# Altium schematic sheet Sheet4.SchDoc
size A3; SheetNumber: 4; SheetTotal: 4
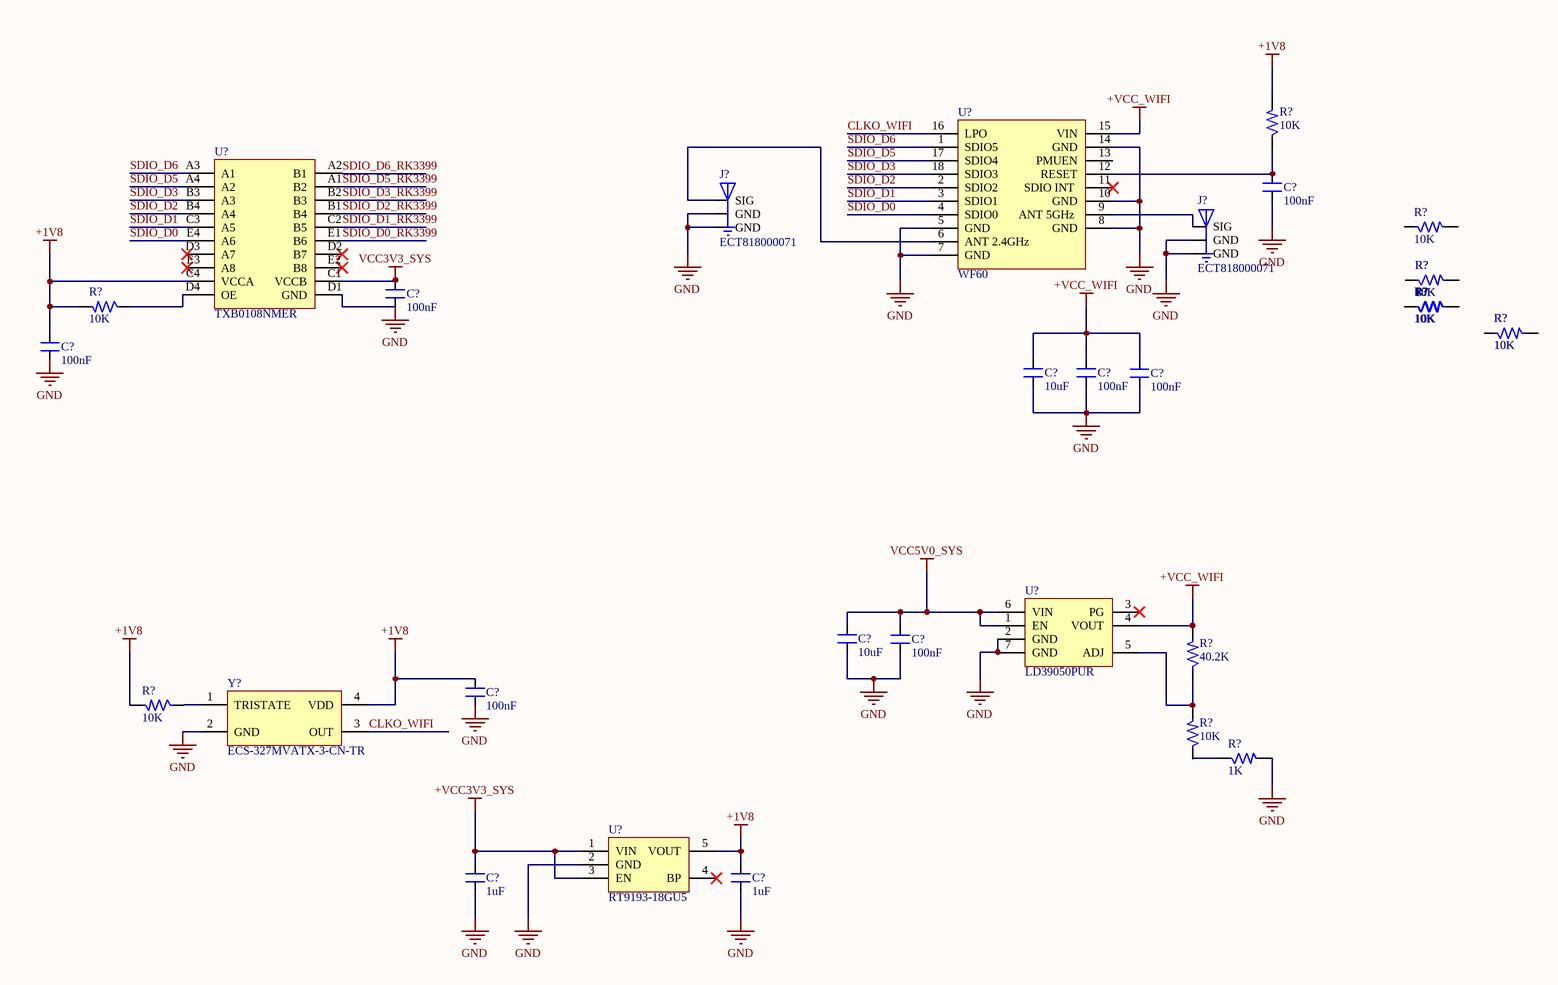
[diagram p0: Sheet4.SchDoc]

## Parts
(Parts that share a designator on the sheet are numbered #1, #2 ... from top to bottom, then left to right.)
C?#1  100nF  [CAP_0402]
C?#2  100nF  [CAP_0402]
C?#3  100nF  [CAP_0402]
C?#4  10uF  [CAP_0402]
C?#5  100nF  [CAP_0402]
C?#6  100nF  [CAP_0402]
C?#7  10uF  [CAP_0402]
C?#8  100nF  [CAP_0402]
C?#9  100nF  [CAP_0402]
C?#10  1uF  [CAP_0402]
C?#11  1uF  [CAP_0402]
J?#1  ECT818000071  [CON3_UFL_116_SMD_ST]
J?#2  ECT818000071  [CON3_UFL_116_SMD_ST]
R?#1  10K  [RES_0201]
R?#2  10K  [RES_0603]
R?#3  10K  [RES_0603]
R?#4  10K  [RES_0603]
R?#5  10K  [RES_0201]
R?#6  10K  [RES_0603]
R?#7  10K  [RES_0603]
R?#8  10K  [RES_0603]
R?#9  10K  [RES_0603]
R?#10  40.2K  [RES_0805]
R?#11  10K  [RES_0201]
R?#12  10K  [RES_0201]
R?#13  1K  [RES_0603]
U?#1  WF60  [MOD_WF60]
U?#2  TXB0108NMER  [NFBGA_31.4_125.9X102.36]
U?#3  LD39050PUR  [DFN-6_37.4_165_33X15_SMD]
U?#4  RT9193-18GU5  [SC70-5]
Y?  ECS-327MVATX-3-CN-TR  [XTAL_57_35X31_SMD]

## Nets
+1V8: C?#3.2 C?#9.2 C?#11.2 R?#1.2 R?#5.2 R?#11.2 U?#2.C4(VCCA) U?#4.5(VOUT) Y?.4(VDD)
+VCC3V3_SYS: C?#10.2 U?#4.1(VIN) U?#4.3(EN)
+VCC_WIFI: C?#4.2 C?#5.2 C?#6.2 R?#10.2 U?#1.15(VIN) U?#3.4(VOUT)
GND: C?#1.1 C?#2.1 C?#3.1 C?#4.1 C?#5.1 C?#6.1 C?#7.1 C?#8.1 C?#9.1 C?#10.1 C?#11.1 J?#1.1(GND) J?#1.3(GND) J?#2.1(GND) J?#2.3(GND) R?#13.2 U?#1.5(GND) U?#1.7(GND) U?#1.8(GND) U?#1.10(GND) U?#1.14(GND) U?#2.D1(GND) U?#3.2(GND) U?#3.7(GND) U?#4.2(GND) Y?.2(GND)
VCC3V3_SYS: C?#2.2 U?#2.C1(VCCB)
VCC5V0_SYS: C?#7.2 C?#8.2 U?#3.1(EN) U?#3.6(VIN)
CLKO_WIFI: U?#1.16(LPO) Y?.3(OUT)
SDIO_D0: U?#1.4(SDIO0) U?#2.E4(A6)
SDIO_D0_RK3399: U?#2.E1(B6)
SDIO_D1: U?#1.3(SDIO1) U?#2.C3(A5)
SDIO_D1_RK3399: U?#2.C2(B5)
SDIO_D2: U?#1.2(SDIO2) U?#2.B4(A4)
SDIO_D2_RK3399: U?#2.B1(B4)
SDIO_D3: U?#1.18(SDIO3) U?#2.B3(A3)
SDIO_D3_RK3399: U?#2.B2(B3)
SDIO_D5: U?#1.17(SDIO4) U?#2.A4(A2)
SDIO_D5_RK3399: U?#2.A1(B2)
SDIO_D6: U?#1.1(SDIO5) U?#2.A3(A1)
SDIO_D6_RK3399: U?#2.A2(B1)
NetC?#1_2: C?#1.2 R?#1.1 U?#1.12(RESET)
NetJ?#1_2: J?#1.2(SIG) U?#1.6(ANT_2.4GHz)
NetJ?#2_2: J?#2.2(SIG) U?#1.9(ANT_5GHz)
NetR?#3_1: R?#3.1 R?#4.1
NetR?#3_2: R?#3.2 R?#4.2
NetR?#5_1: R?#5.1 U?#2.D4(OE)
NetR?#8_1: R?#8.1 R?#9.1
NetR?#8_2: R?#8.2 R?#9.2
NetR?#10_1: R?#10.1 R?#12.2 U?#3.5(ADJ)
NetR?#11_1: R?#11.1 Y?.1(TRISTATE)
NetR?#12_1: R?#12.1 R?#13.1

Not connected (* = marked no-connect by the designer): R?#2 1 2; R?#6 1 2; R?#7 1 2; U?#1 11(SDIO_INT_)* 13(PMUEN); U?#2 D2(B7)* D3(A7)* E2(B8)* E3(A8)*; U?#3 3(PG)*; U?#4 4(BP)*

## Library data of the parts
C?#1-C?#3 C?#5 C?#6 C?#8 C?#9 = CAP_100nF-10V-10%-0402: 0.1µF ±10% 10V Ceramic Capacitor X7R 0402 (1005 Metric); Manufacturer: Yageo; Manufacturer Part Number: CC0402KRX7R6BB104; Case/Package: 0402; Supplier-1: Digikey
C?#4 C?#7 = CAP_10uF-10V-20%-0402: 10µF ±20% 10V Ceramic Capacitor X5R 0402 (1005 Metric); Manufacturer Part Number: CL05A106MP5NUNC; Manufacturer: Samsung Electro-Mechanics; Case/Package: 0402; Supplier-1: Digikey
C?#10 C?#11 = CAP_1uF-10V-10%-0402: 1µF ±10% 10V Ceramic Capacitor X6S 0402 (1005 Metric); Manufacturer: Murata Electronics; Manufacturer Part Number: GRT155C81A105KE01D; Case/Package: 0402; Supplier-1: Digikey
J?#1 J?#2 = CON-PLG_3X1-ECT818000071-ST-SMD: SMD RF Connectors/Coaxial Connectors RoHS; Manufacturer: ECT; Manufacturer Part Number: ECT818000071; Case/Package: SMD; Supplier-1: LCSC
R?#1 R?#5 R?#11 R?#12 = RES_10K-0.05W-1%-0201: 10 kOhms ±1% 0.05W, 1/20W Chip Resistor 0201 (0603 Metric) Thick Film; Manufacturer: Stackpole Electronics Inc; Manufacturer Part Number: RMCF0201FT10K0; Case/Package: 0201; Supplier-1: Digikey
R?#2-R?#4 R?#6-R?#9 = RES_10K-0.1W-1%-0603: 10 kOhms ±1% 0.1W, 1/10W Chip Resistor 0603 (1608 Metric) Thick Film; Manufacturer: Yageo; Manufacturer Part Number: RC0603FR-0710KL; Case/Package: 0603; Supplier-1: Digikey
R?#10 = RES_40.2K-0.125W-1%-0805: 40.2 kOhms ±1% 0.125W, 1/8W Chip Resistor 0805 (2012 Metric) Automotive AEC-Q200 Thick Film; Manufacturer: TE Connectivity; Manufacturer Part Number: RMCF0805FT40K2; Alternate Part Number-1: NA; Case/Package: 0805; Supplier-1: SIRICOM; Supplier Part Number-1: WR08X4022FTL; Category: Resistor; Number of Pins: 2
R?#13 = RES_1K-0.1W-1%-0603: 1 kOhms ±1% 0.1W, 1/10W Chip Resistor 0603 (1608 Metric) Thick Film; Manufacturer: Yageo; Manufacturer Part Number: RC0603FR-071KL; Case/Package: 0603; Supplier-1: Digikey
U?#1 = MOD_WF60-SMD: Amp’ed RF Tech presents the WF60 WiFi dual / band module: 802.11abgn.; Alternate Part Number-1: NA; Manufacturer: Amp’ed; Manufacturer Part Number: WF60; Case/Package: SMD; Supplier-1: Arrow; Supplier Part Number-1: WF60; Category: Module; Number of Pins: 16
U?#2 = IC_TXB0108NMER: Translation - Voltage Levels 8-Bit Bidirectional Voltage-Level Shifter with Auto Direction Sensing and +/-15-kV ESD Protect; Manufacturer: Texas Instruments; Manufacturer Part Number: TXB0108NMER; Case/Package: NFBGA-20; Supplier-1: Mouser
U?#3 = REG_5.5V-0~5.1V-0.5A-2.55W-DFN-6: Adjustable 5.5V 0.8V 500mA DFN-6 Linear Voltage Regulators RoHS; Manufacturer: STMicroelectronics; Alternate Part Number-1: NA; Manufacturer Part Number: LD39050PUR; Case/Package: DFN-6; Supplier-1: LCSC; Supplier Part Number-1: C222094; Category: Regulators; Number of Pins: 6
U?#4 = REG_1.8V-300mA-5.5V-SC70-5: Linear Voltage Regulator IC 1 Output 300mA SC-70-5; Manufacturer: Richtek USA Inc.; Manufacturer Part Number: RT9193-18GU5; Case/Package: SC70-5; Supplier-1: Digikey
Y? = XTAL_ECS-327MVATX-2-CN-TR: 32.768kHz XO (Standard) CMOS Oscillator 1.6V ~ 3.6V Enable/Disable 4-SMD, No Lead; Manufacturer: ECS INC; Alternate Part Number-1: NA; Manufacturer Part Number: ECS-327MVATX-3-CN-TR; Case/Package: SMD-4; Supplier-1: Digikey; Supplier Part Number-1: ECS-327MVATX-3-CN-TR; Category: Crystal; Number of Pins: 4